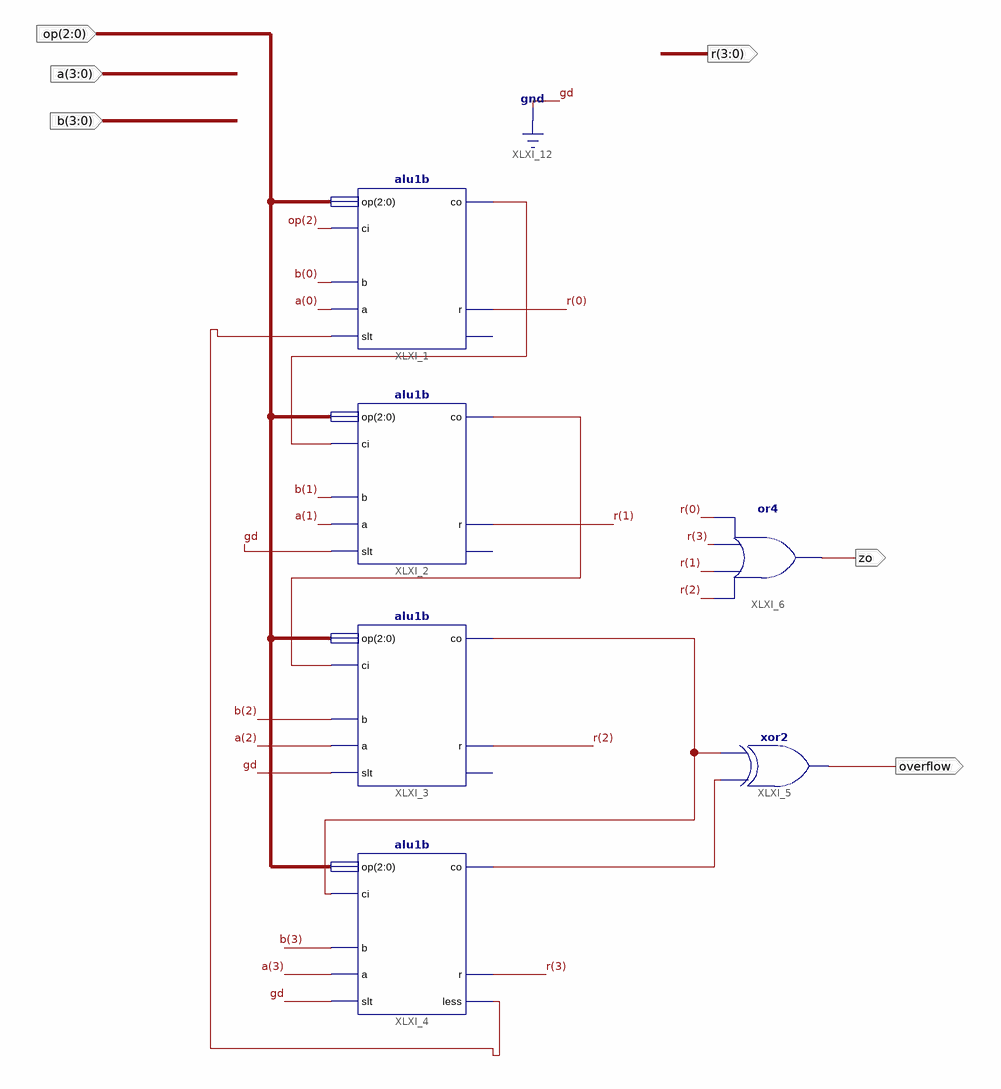
[diagram p0: schematic sheet 1]
// Xilinx ISE schematic alu.sch (spartan3e) as structural Verilog: 6 symbols, 6 ports
module alu (
  input  [2:0] op,
  input  [3:0] a,
  input  [3:0] b,
  output [3:0] r,
  output overflow,
  output zo
);

  wire XLXN_4, XLXN_23, XLXN_30, XLXN_33, XLXN_37;

  alu1b XLXI_1 (.op(op), .ci(op[2]), .b(b[0]), .a(a[0]), .co(XLXN_4), .r(r[0]), .slt(XLXN_30));  // open: less
  alu1b XLXI_2 (.op(op), .ci(XLXN_4), .b(b[1]), .a(a[1]), .co(XLXN_37), .r(r[1]), .slt(1'b0));  // open: less
  alu1b XLXI_3 (.op(op), .ci(XLXN_37), .b(b[2]), .a(a[2]), .co(XLXN_33), .r(r[2]), .slt(1'b0));  // open: less
  alu1b XLXI_4 (.op(op), .ci(XLXN_33), .b(b[3]), .a(a[3]), .co(XLXN_23), .r(r[3]), .slt(1'b0), .less(XLXN_30));
  xor XLXI_5 (overflow, XLXN_23, XLXN_33);
  or XLXI_6 (zo, r[2], r[1], r[3], r[0]);
endmodule
